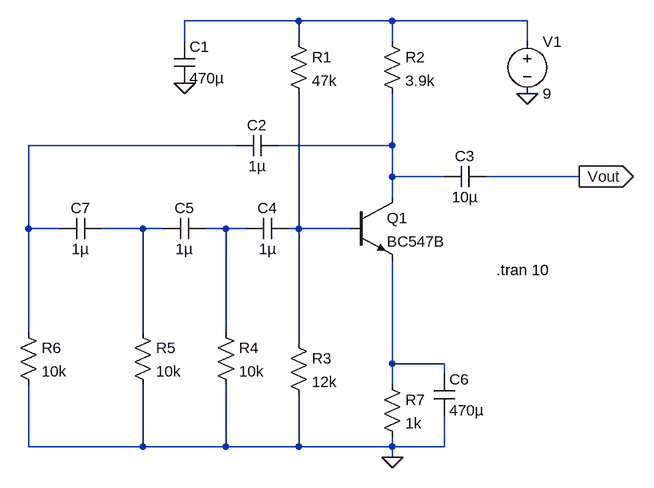
[diagram p0: schematic find_cap.asc]
find_cap.asc, the LTspice schematic file:
Version 4
SHEET 1 880 688
WIRE 208 -16 32 -16
WIRE 352 -16 208 -16
WIRE 560 -16 352 -16
WIRE 32 16 32 -16
WIRE 208 16 208 -16
WIRE 352 16 352 -16
WIRE 560 16 560 -16
WIRE 112 176 -208 176
WIRE 352 176 352 96
WIRE 352 176 176 176
WIRE 352 224 352 176
WIRE 432 224 352 224
WIRE 640 224 496 224
WIRE 352 256 352 224
WIRE -208 304 -208 176
WIRE -160 304 -208 304
WIRE -32 304 -96 304
WIRE 0 304 -32 304
WIRE 96 304 64 304
WIRE 128 304 96 304
WIRE 208 304 208 96
WIRE 208 304 192 304
WIRE 288 304 208 304
WIRE -208 464 -208 304
WIRE -32 464 -32 304
WIRE 96 464 96 304
WIRE 208 480 208 304
WIRE 352 512 352 352
WIRE 432 512 352 512
WIRE 432 528 432 512
WIRE 352 544 352 512
WIRE -208 640 -208 544
WIRE -32 640 -32 544
WIRE -32 640 -208 640
WIRE 96 640 96 544
WIRE 96 640 -32 640
WIRE 208 640 208 560
WIRE 208 640 96 640
WIRE 352 640 352 624
WIRE 352 640 208 640
WIRE 432 640 432 592
WIRE 432 640 352 640
WIRE 352 656 352 640
FLAG 352 656 0
FLAG 640 224 Vout
IOPIN 640 224 Out
FLAG 560 96 0
FLAG 32 80 0
SYMBOL res 192 0 R0
SYMATTR InstName R1
SYMATTR Value 47k
SYMBOL res 336 0 R0
SYMATTR InstName R2
SYMATTR Value 3.9k
SYMBOL npn 288 256 R0
SYMATTR InstName Q1
SYMATTR Value BC547B
SYMBOL res 192 464 R0
SYMATTR InstName R3
SYMATTR Value 12k
SYMBOL res 336 528 R0
SYMATTR InstName R7
SYMATTR Value 1k
SYMBOL voltage 560 0 R0
SYMATTR InstName V1
SYMATTR Value 9
SYMBOL res 80 448 R0
SYMATTR InstName R4
SYMATTR Value 10k
SYMBOL res -48 448 R0
SYMATTR InstName R5
SYMATTR Value 10k
SYMBOL cap 16 16 R0
SYMATTR InstName C1
SYMATTR Value 470µ
SYMBOL cap 496 208 R90
WINDOW 0 0 32 VBottom 2
WINDOW 3 32 32 VTop 2
SYMATTR InstName C3
SYMATTR Value 10µ
SYMBOL cap 192 288 R90
WINDOW 0 0 32 VBottom 2
WINDOW 3 32 32 VTop 2
SYMATTR InstName C4
SYMATTR Value 1µ
SYMBOL cap 64 288 R90
WINDOW 0 0 32 VBottom 2
WINDOW 3 32 32 VTop 2
SYMATTR InstName C5
SYMATTR Value 1µ
SYMBOL cap 176 160 R90
WINDOW 0 0 32 VBottom 2
WINDOW 3 32 32 VTop 2
SYMATTR InstName C2
SYMATTR Value 1µ
SYMBOL cap 416 528 R0
SYMATTR InstName C6
SYMATTR Value 470µ
SYMBOL cap -96 288 R90
WINDOW 0 0 32 VBottom 2
WINDOW 3 32 32 VTop 2
SYMATTR InstName C7
SYMATTR Value 1µ
SYMBOL res -224 448 R0
SYMATTR InstName R6
SYMATTR Value 10k
TEXT 512 368 Left 2 !.tran 10

The netlist it stands for:
* find_cap.asc
R1 N001 N006 47k
R2 N001 N003 3.9k
Q1 N003 N006 N007 0 BC547B
R3 N006 0 12k
R7 N007 0 1k
V1 N001 0 9
R4 N005 0 10k
R5 N004 0 10k
C1 N001 0 470µ
C3 Vout N003 10µ
C4 N006 N005 1µ
C5 N005 N004 1µ
C2 N003 N002 1µ
C6 N007 0 470µ
C7 N004 N002 1µ
R6 N002 0 10k
.model NPN NPN
.model PNP PNP
.lib standard.bjt
.tran 10
.backanno
.end